# Altium schematic sheet 02_SPEAKER & LED STRIPS.SchDoc
size A4
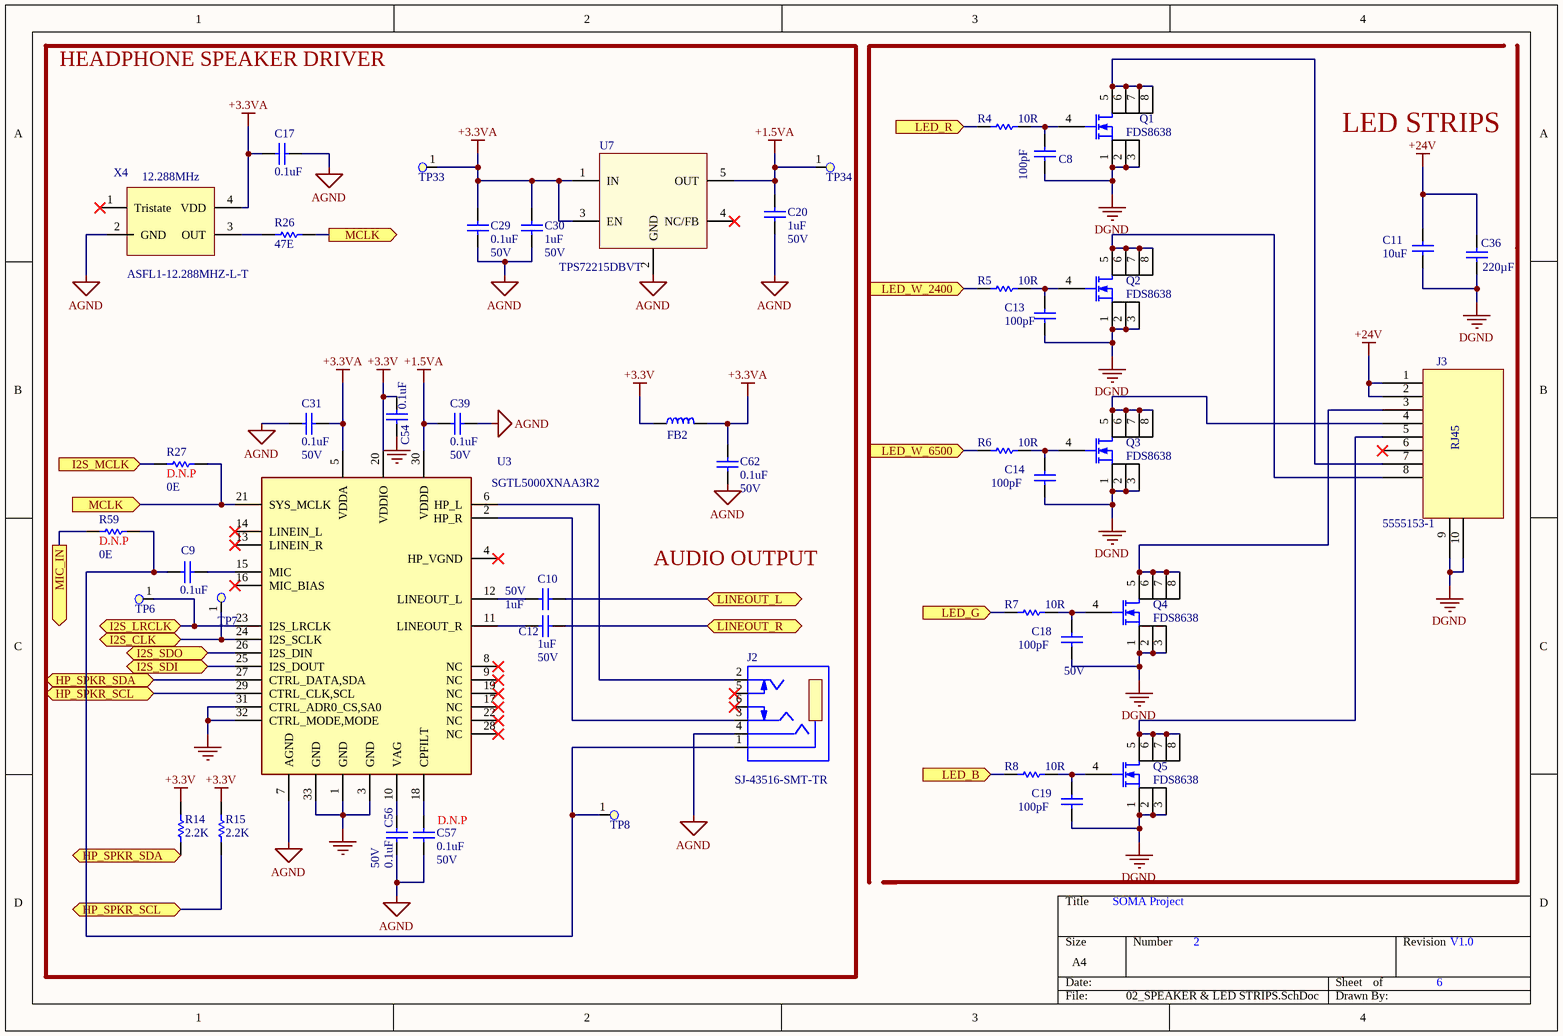
[diagram p0: 02_SPEAKER & LED STRIPS.SchDoc]

## Parts
C8  value 100pF  [C0402]  (hidden comment: CAP CER 100PF 50V C0G/NP0 0402)
C9  0.1uF  [C0603]
C10  value 1uF  Rating: 50V  [C0402]  (hidden comment: CAP CER 1UF 50V X5R 0402)
C11  value 10uF  [C1206]  (hidden comment: CAP CER 10UF 50V X5R 1206)
C12  value 1uF  Rating: 50V  [C0402]  (hidden comment: CAP CER 1UF 50V X5R 0402)
C13  value 100pF  [C0402]  (hidden comment: CAP CER 100PF 50V C0G/NP0 0402)
C14  value 100pF  [C0402]  (hidden comment: CAP CER 100PF 50V C0G/NP0 0402)
C17  0.1uF  [C0603]
C18  value 100pF  Rating: 50V  [C0402]  (hidden comment: CAP CER 100PF 50V C0G/NP0 0402)
C19  value 100pF  [C0402]  (hidden comment: CAP CER 100PF 50V C0G/NP0 0402)
C20  value 1uF  Rating: 50V  [C0603]  (hidden comment: CAP CER 1UF 50V X5R 0603)
C29  Rating: 50V  [C0402]  (hidden comment: 0.1uF)
C30  value 1uF  Rating: 50V  [C0603]  (hidden comment: CAP CER 1UF 50V X5R 0603)
C31  Rating: 50V  [C0402]  (hidden comment: 0.1uF)
C36  value 220µF  [C1206]  (hidden comment: CAP CER 220UF 4V X5R 1206)
C39  Rating: 50V  [C0402]  (hidden comment: 0.1uF)
C54  0.1uF  [C0603]
C56  Rating: 50V  [C0402]  (hidden comment: 0.1uF)
C57  Assembly Option: D.N.P  Rating: 50V  [C0402]  (hidden comment: 0.1uF)
C62  Rating: 50V  [C0402]  (hidden comment: 0.1uF)
FB2  600 Ohms @ 100MHz  [FB0603]  (value not drawn)
J2  Manufacturer part Number: SJ-43516-SMT-TR  [CUI_SJ-43516-SMT-TR]  (hidden comment: CONN JACK 4COND 3.5MM SMD R/A)
J3  value 5555153-1  [TE_55551531]  (hidden comment: CONN MOD JACK 8P8C R/A SHIELDED)
Q1  value FDS8638  [SOIC127P600X175-8N]  (hidden comment: MOSFET N-CH 40V 18A 8SOIC)
Q2  value FDS8638  [SOIC127P600X175-8N]  (hidden comment: MOSFET N-CH 40V 18A 8SOIC)
Q3  value FDS8638  [SOIC127P600X175-8N]  (hidden comment: MOSFET N-CH 40V 18A 8SOIC)
Q4  value FDS8638  [SOIC127P600X175-8N]  (hidden comment: MOSFET N-CH 40V 18A 8SOIC)
Q5  value FDS8638  [SOIC127P600X175-8N]  (hidden comment: MOSFET N-CH 40V 18A 8SOIC)
R4  value 10R  [R0402]  (hidden comment: RES SMD 10 OHM 5% 1/16W 0402)
R5  value 10R  [R0402]  (hidden comment: RES SMD 10 OHM 5% 1/16W 0402)
R6  value 10R  [R0402]  (hidden comment: RES SMD 10 OHM 5% 1/16W 0402)
R7  value 10R  [R0402]  (hidden comment: RES SMD 10 OHM 5% 1/16W 0402)
R8  value 10R  [R0402]  (hidden comment: RES SMD 10 OHM 5% 1/16W 0402)
R14  value 2.2K  [R0402]  (hidden comment: RES 2.2K OHM 1% 1/16W 0402)
R15  value 2.2K  [R0402]  (hidden comment: RES 2.2K OHM 1% 1/16W 0402)
R26  value 47E  [R0402]  (hidden comment: RES SMD 47 OHM 5% 1/10W 0402)
R27  Assembly Option: D.N.P  [R0603]  (hidden comment: 0E)
R59  Assembly Option: D.N.P  [R0603]  (hidden comment: 0E)
TP6  Test Point,1.6mm Diameter,SMD  [TP_63C]  (value not drawn)  (no BOM)
TP7  Test Point,1.6mm Diameter,SMD  [TP_63C]  (value not drawn)  (no BOM)
TP8  Test Point,1.6mm Diameter,SMD  [TP_63C]  (value not drawn)  (no BOM)
TP33  Test Point,1.6mm Diameter,SMD  [TP_63C]  (value not drawn)  (no BOM)
TP34  Test Point,1.6mm Diameter,SMD  [TP_63C]  (value not drawn)  (no BOM)
U3  value SGTL5000XNAA3R2  [QFN50P500X500X100-33N]  (hidden comment: IC AUDIO CODEC STEREO 32-QFN)
U7  TPS72215DBVT  [SOT95P280X145-5N]
X4  value 12.288MHz  Manufacturer part Number: ASFL1-12.288MHZ-L-T  [XTAL500X320X130-4N]  (hidden comment: XTAL OSC XO 12.2880MHZ HCMOS TTL)

## Ports
HP_SPKR_SCL (bidir), HP_SPKR_SDA (bidir), I2S_CLK (bidir), I2S_LRCLK (bidir), I2S_MCLK (in), I2S_SDI (bidir), I2S_SDO (bidir), LED_B (in), LED_G (in), LED_R (in), LED_W_2400 (in), LED_W_6500 (in), LINEOUT_L (bidir), LINEOUT_R (bidir), MCLK (in), MCLK (out), MIC_IN (out)

## Nets
+1.5VA: C20.2 C39.2 TP34.1 U3.30(VDDD) U7.5(OUT)
+3.3V: C54.1 FB2.2 R14.2 R15.2 U3.20(VDDIO)
+3.3VA: C17.2 C29.1 C30.2 C31.1 C62.2 FB2.1 TP33.1 U3.5(VDDA) U7.1(IN) U7.3(EN) X4.4(VDD)
+24V: C11.2 C36.2 J3.1 J3.2
AGND: C17.1 C20.1 C29.2 C30.1 C31.2 C39.1 C56.1 C57.1 C62.1 J2.4(RING2) U3.7(AGND) U7.2(GND) X4.2(GND)
DGND: C8.1 C11.1 C13.1 C14.1 C18.1 C19.1 C36.1 J3.9 J3.10 Q1.1 Q1.2 Q1.3 Q2.1 Q2.2 Q2.3 Q3.1 Q3.2 Q3.3 Q4.1 Q4.2 Q4.3 Q5.1 Q5.2 Q5.3
GND: C54.2 U3.1(GND) U3.3(GND) U3.31(CTRL_ADR0_CS,SA0) U3.32(CTRL_MODE,MODE) U3.33(GND)
HP_SPKR_SCL: R15.1 U3.29(CTRL_CLK,SCL) ; port HP_SPKR_SCL
HP_SPKR_SDA: R14.1 U3.27(CTRL_DATA,SDA) ; port HP_SPKR_SDA
I2S_CLK: TP7.1 U3.24(I2S_SCLK) ; port I2S_CLK
I2S_LRCLK: TP6.1 U3.23(I2S_LRCLK) ; port I2S_LRCLK
I2S_MCLK: R27.2 ; port I2S_MCLK
I2S_SDI: U3.25(I2S_DOUT) ; port I2S_SDI
I2S_SDO: U3.26(I2S_DIN) ; port I2S_SDO
LED_B: R8.1 ; port LED_B
LED_G: R7.1 ; port LED_G
LED_R: R4.1 ; port LED_R
LED_W_2400: R5.1 ; port LED_W_2400
LED_W_6500: R6.1 ; port LED_W_6500
LINEOUT_L: C10.2 ; port LINEOUT_L
LINEOUT_R: C12.2 ; port LINEOUT_R
MCLK: R26.2 R27.1 U3.21(SYS_MCLK) ; port MCLK
MIC_IN: R59.2 ; port MIC_IN
NetC8_2: C8.2 Q1.4 R4.2
NetC9_1: C9.1 U3.15(MIC)
NetC9_2: C9.2 J2.1(SLEEVE) R59.1 TP8.1
NetC10_1: C10.1 U3.12(LINEOUT_L)
NetC12_1: C12.1 U3.11(LINEOUT_R)
NetC13_2: C13.2 Q2.4 R5.2
NetC14_2: C14.2 Q3.4 R6.2
NetC18_2: C18.2 Q4.4 R7.2
NetC19_2: C19.2 Q5.4 R8.2
NetC56_2: C56.2 U3.10(VAG)
NetC57_2: C57.2 U3.18(CPFILT)
NetJ2_2: J2.2(TIP) U3.6(HP_L)
NetJ2_3: J2.3(RING1) U3.2(HP_R)
NetJ3_3: J3.3 Q4.5 Q4.6 Q4.7 Q4.8
NetJ3_4: J3.4 Q3.5 Q3.6 Q3.7 Q3.8
NetJ3_5: J3.5 Q5.5 Q5.6 Q5.7 Q5.8
NetJ3_7: J3.7 Q1.5 Q1.6 Q1.7 Q1.8
NetJ3_8: J3.8 Q2.5 Q2.6 Q2.7 Q2.8
NetR26_1: R26.1 X4.3(OUT)

Not connected (* = marked no-connect by the designer): J2 5(TIP_SWITCH)* 6(RING_SWITCH)*; J3 6*; U3 4(HP_VGND)* 8(NC)* 9(NC)* 13(LINEIN_R)* 14(LINEIN_L)* 16(MIC_BIAS)* 17(NC)* 19(NC)* 22(NC)* 28(NC)*; U7 4(NC/FB)*; X4 1(Tristate)*

## Notes on the sheet
- HEADPHONE SPEAKER DRIVER
- LED STRIPS
- AUDIO OUTPUT
- SOMA Project
- 2
- 6
- V1.0
- (in symbol CONN MOD JACK 8P8C R/A SHIELDED) RJ45

## Library data of the parts
C8 C13 C14 C18 C19 = CAP CER 100PF 50V C0G/NP0 0402: 100 pF ±5% 50V Ceramic Capacitor C0G, NP0 0402 (1005 Metric); Manufacturer: KEMET; Manufacturer part Number: C0402C101J5GACTU; Tolerance: ±5%; Operating Temperature: -55°C ~ 125°C; Package: 0402 (1005 Metric); Distributor: Digikey; Distributor part Number: 399-3194-1-ND; Reference link: https://www.digikey.com/en/products/detail/kemet/C0402C101J5GACTU/569895?s=N4IgTCBcDaIMIAYAsCxwIwPQKQKwHEBBOAFQFUQBdAXyA; Unit Price: $0.10000; Type: CAP
  C8 C13 C14 C19: Rating: 50V
C9 C17 C54 = CAP CER 0.1UF 10V X7R 0603: Manufacturer: Würth Elektronik; Manufacturer part Number: 885012206020; Tolerance: ±10%; Operating Temperature: -55°C ~ 125°C; Reference link: https://www.digikey.com/en/products/detail/w%C3%BCrth-elektronik/885012206020/5453794; Package: 0603 (1608 Metric); Distributor: Digikey; Distributor part Number: 732-7939-1-ND; Type: CAP; Unit Price: $0.10000; Value: 0.1uF; Rating: 10V
C10 C12 = CAP CER 1UF 50V X5R 0402: 1 µF ±10% 50V Ceramic Capacitor X5R 0402 (1005 Metric); Manufacturer: Taiyo Yuden; Manufacturer part Number: UMK105CBJ105KV-F; Tolerance: ±10%; Operating Temperature: -55°C ~ 85°C; Reference link: https://www.digikey.com/en/products/detail/taiyo-yuden/UMK105CBJ105KV-F/7403870; Package: 0402 (1005 Metric); Distributor: Digikey; Distributor part Number: 587-UMK105CBJ105KV-FCT-ND; Type: CAP; Unit Price: $0.32000
C11 = CAP CER 10UF 50V X5R 1206: 10µF ±20% 50V Ceramic Capacitor X5R 1206 (3216 Metric); Manufacturer: Samsung Electro-Mechanics; Manufacturer part Number: CL31A106MBHNNNE; Tolerance: ±20%; Operating Temperature: -55°C ~ 85°C; Type: CAP; Package: 1206 (3216 Metric); Reference link: https://www.digikey.in/product-detail/en/samsung-electro-mechanics/CL31A106MBHNNNE/1276-6736-2-ND/5961220; Distributor: Digikey; Distributor part Number: 1276-6736-2-ND; Unit Price: 5.29660; Rating: 50V; Part Status: Active
C20 C30 = CAP CER 1UF 50V X5R 0603: Manufacturer: Taiyo Yuden; Manufacturer part Number: UMK107BJ105KA-T; Tolerance: ±10%; Operating Temperature: -55°C ~ 125°C; Reference link: https://www.digikey.in/product-detail/en/taiyo-yuden/UMK107BJ105KA-T/587-2400-2-ND/2178919; Package: 0603; Distributor: Digikey; Distributor part Number: 587-2400-2-ND; Type: CAP; Unit Price: 2.57370
C29 C31 C39 C56 C57 C62 = CAP CER 0.1UF 50V X7R 0402: Manufacturer: AVX; Manufacturer part Number: 04025C104KAT2A; Tolerance: ±10%; Operating Temperature: -55°C ~ 125°C; Value: 0.1uF; Package: 0402; Distributor: Mouser; Reference link: https://www.mouser.in/ProductDetail/AVX/04025C104KAT2A?qs=%2Fha2pyFaduhvAwOoQhW9hDDlPxePcbvdgYQJEdBTMGpxgpoTOSNvPA%3D%3D; Distributor part Number: 581-04025C104KAT2A; Type: CAP; Unit Price: ₹7.47
C36 = CAP CER 220UF 4V X5R 1206: 220µF ±20% 4V Ceramic Capacitor X5R 1206 (3216 Metric); Manufacturer: Murata Electronics; Manufacturer part Number: GRM31CR60G227ME11L; Distributor: Digikey; Package: 1206 (3216 Metric); Type: CAP; Operating Temperature: -55°C ~ 85°C; Distributor part Number: 490-9774-2-ND; Reference link: https://www.digikey.in/product-detail/en/murata-electronics/GRM31CR60G227ME11L/490-9774-2-ND/4969458; Tolerance: ±20%; Unit Price: 34.53501; Rating: 4V
FB2 = FERRITE BEAD 600 OHM 0603 1LN: Manufacturer: Murata; Manufacturer part Number: BLM18AG601SN1D; Type: FB; Assembly Option: DNP; Value: 600 Ohms @ 100MHz; Distributor: Digikey; Package: 0603; Operating Temperature: -55°C ~ 125°C; Rating: 600 Ohms @ 100MHz; Distributor part Number: 490-1014-2-ND; Reference link: https://www.digikey.com/product-detail/en/murata-electronics-north-america/BLM18AG601SN1D/490-1014-2-ND/584225; Unit Price: $0.02306
J2 = CONN JACK 4COND 3.5MM SMD R/A: 3.50mm (0.141", 1/8", Mini Plug) - Headphone Phone Jack Stereo (4 Conductor, TRRS) Connector Solder; Manufacturer: CUI Devices; Rating: 12VDC; Tolerance: NA; Value: SJ-43516-SMT-TR; Operating Temperature: -20°C ~ 85°C; Unit Price: $1.10000; Distributor: Digikey; Distributor part Number: CP-43516SJCT-ND; Package: Cut Tape (CT); Reference link: https://www.digikey.com/en/products/detail/cui-devices/SJ-43516-SMT-TR/669721; Type: Phone Jack,Surface Mount, Right Angle
J3 = CONN MOD JACK 8P8C R/A SHIELDED: Jack Modular Connector 8p8c (RJ45, Ethernet) 90° Angle (Right) Shielded Cat3; Manufacturer: TE Connectivity AMP Connectors; Tolerance: NA; Unit Price: $2.11000; Distributor: Digikey; Distributor part Number: A31438-ND; Manufacturer part Number: 5555153-1; Package: Tray; Rating: Cat3; Reference link: https://www.digikey.com/en/products/detail/te-connectivity-amp-connectors/5555153-1/769582?s=N4IgTCBcDaIKwLgRjgZgLRJAXQL5A; Type: Modular Connectors - Jacks, Through hole; Operating Temperature: -40°C ~ 85°C
Q1-Q5 = MOSFET N-CH 40V 18A 8SOIC: N-Channel 40 V 18A (Ta) 2.5W (Ta) Surface Mount 8-SOIC; Manufacturer: ON Semiconductor; Rating: 40 V 18A 2.5W; Tolerance: NA; Type: Transistors - FETs, MOSFETs - Single, N-Channel; Unit Price: $2.12000; Distributor: Digikey; Distributor part Number: FDS8638CT-ND; Manufacturer part Number: FDS8638; Package: 8-SOIC (0.154", 3.90mm Width); Reference link: https://www.digikey.com/en/products/detail/on-semiconductor/FDS8638/2051638?s=N4IgTCBcDaIGIBEDKAOAbAZhSAugXyA
R4-R8 = RES SMD 10 OHM 5% 1/16W 0402: 10 Ohms ±5% 0.063W, 1/16W Chip Resistor 0402 (1005 Metric) Automotive AEC-Q200 Thick Film; Manufacturer: Vishay Dale; Manufacturer part Number: CRCW040210R0JNED; Rating: AEC-Q200  0.063W, 1/16W; Tolerance: ±5%; Distributor: Digikey; Package: 0402 (1005 Metric); Operating Temperature: -55°C ~ 155°C; Type: RES; Distributor part Number: 541-10JCT-ND; Reference link: https://www.digikey.com/en/products/detail/vishay-dale/CRCW040210R0JNED/1177520; Unit Price: $0.10000
R14 R15 = RES SMD 10 OHM 5% 1/16W 0402: 2.2 kOhms ±1% 0.063W, 1/16W Chip Resistor 0402 (1005 Metric) Moisture Resistant Thick Film; Manufacturer: YAGEO; Manufacturer part Number: RC0402FR-072K2L; Tolerance: ±1%; Distributor: Digikey; Package: 0402 (1005 Metric); Operating Temperature: -55°C ~ 155°C; Type: RES; Distributor part Number: 311-2.20KLRTR-ND; Reference link: https://www.digikey.com/en/products/detail/yageo/RC0402FR-072K2L/726553; Rating: 0.063W, 1/16W; Unit Price: $0.10000
R26 = RES SMD 47 OHM 5% 1/10W 0402: Manufacturer: Panasonic; Manufacturer part Number: ERJ-2GEJ470X; Distributor: Digikey; Distributor part Number: P47JTR-ND; Reference link: https://www.digikey.com/product-detail/en/panasonic-electronic-components/ERJ-2GEJ470X/P47JTR-ND/147020; Package: 0402; Rating: 1/10W; Operating Temperature: -55°C ~ 155°C; Type: RES; Tolerance: ±5%; Unit Price: $0.00395
R27 R59 = RES SMD 0 OHM JUMPER 1/10W 0603: Manufacturer part Number: RC0603JR-070RL; Manufacturer: Yageo; Operating Temperature: -55°C ~ 155°C; Distributor: Digikey; Package: 0603; Type: RES; Distributor part Number: 311-0.0GRCT-ND; Reference link: https://www.digikey.com/product-detail/en/yageo/RC0603JR-070RL/311-0.0GRCT-ND/729622; Rating: 1/10W; Value: 0E; Unit Price: $0.10000
U3 = IC AUDIO CODEC STEREO 32-QFN: Stereo Audio Interface - I²C, Serial, SPI™ 32-QFN-EP (5x5); Manufacturer: NXP USA Inc.; Tolerance: NA; Rating: 1.1V ~ 2V, 1.62V ~ 3.6V; Manufacturer part Number: SGTL5000XNAA3R2; Operating Temperature: -40°C ~ 85°C; Distributor: Digikey; Distributor part Number: SGTL5000XNAA3R2CT-ND; Reference link: https://www.digikey.com/en/products/detail/nxp-usa-inc/SGTL5000XNAA3R2/2186898; Package: 32-VFQFN Exposed Pad; Type: IC; Unit Price: $4.19000
U7 = IC REG LINEAR 1.5V 50MA SOT23-5: Manufacturer: Texas Instruments; Tolerance: NA; Rating: 0.1V@50mA; Distributor part Number: 296-12521-1-ND; Reference link: https://www.digikey.com/en/products/detail/texas-instruments/TPS72215DBVT/432081; Type: IC; Value: TPS72215DBVT; Manufacturer part Number: TPS72215DBVT; Distributor: Digikey; Package: SOT23-5; Operating Temperature: -40°C ~ 125°C; Unit Price: $1.53000
X4 = XTAL OSC XO 12.2880MHZ HCMOS TTL: Manufacturer: Abracon LLC; Rating: 3.3V,100ppm; Distributor: Digikey; Package: 4 SMD, No Lead; Operating Temperature: -40°C ~ 85°C; Type: Crystal; Distributor part Number: 535-10810-1-ND; Reference link: https://www.digikey.com/en/products/detail/abracon-llc/ASFL1-12-288MHZ-L-T/2623937; Unit Price: $1.14000
TP6-TP8 TP33 TP34 = Test Point,1.6mm Diameter,SMD: AEMCI Part Number: *; Vendor: *; Vendor ID: *